# EAGLE design TMdojo-Current-Sensor_v0p2 (EAGLE 7.3.0)
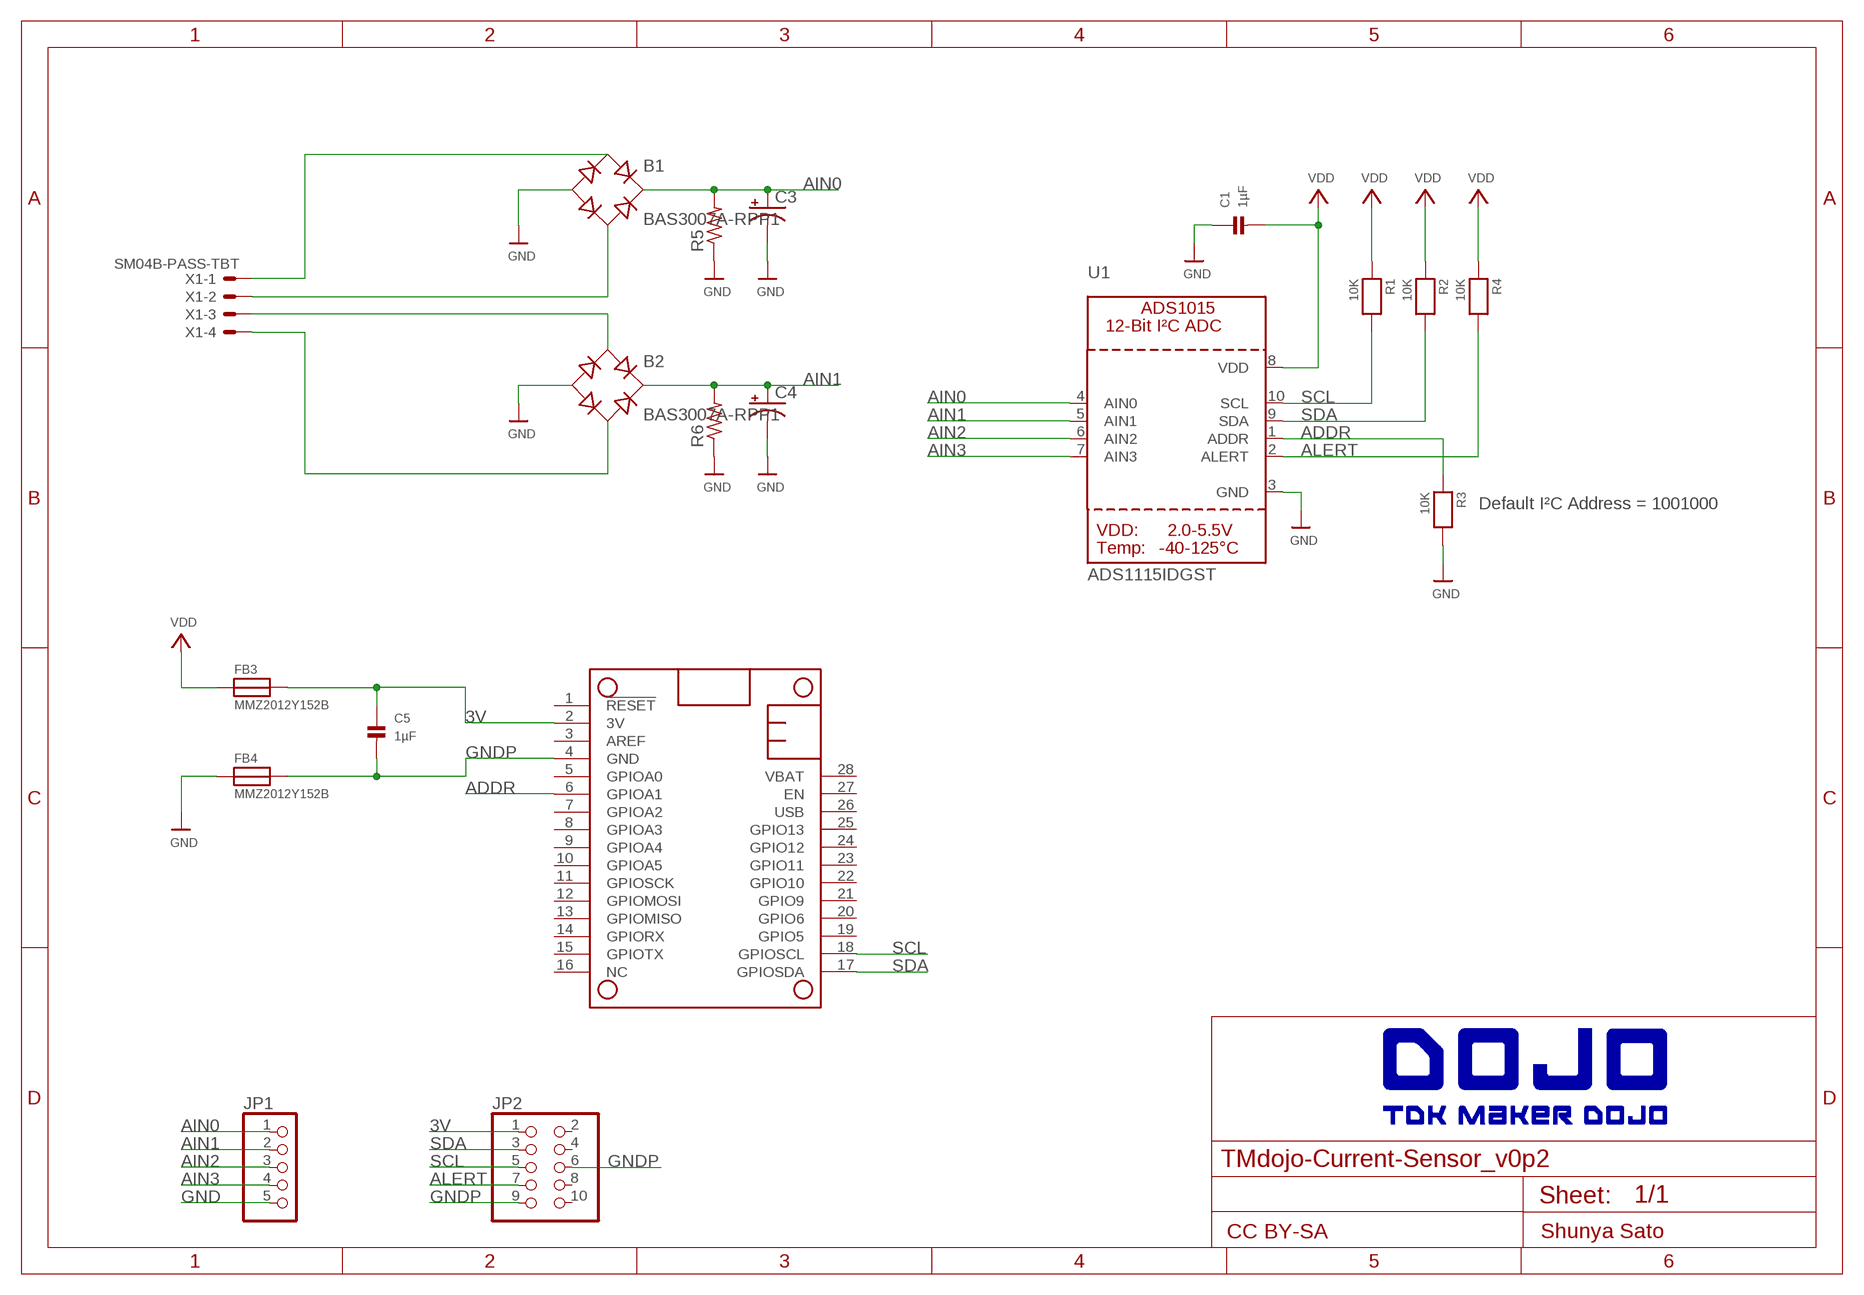
[diagram p0: schematic, sheet 1]

## Parts
B1  BAS3007A-RPP1  [SOT143]
B2  BAS3007A-RPP1  [SOT143]
C1  1µF  CAP_CERAMIC0805  [0805]
C3  CPOL-USTT5D7  [TT5D7]
C4  CPOL-USTT5D7  [TT5D7]
C5  1µF  CAP_CERAMIC0805  [0805]
FB3  MMZ2012Y152B  FERRITE0805  [0805]
FB4  MMZ2012Y152B  FERRITE0805  [0805]
JP1  HEADER-1X5ROUND  [1X05_ROUND]
JP2  HEADER-2X5  [2X05]
MS1  FEATHERWING  [FEATHERWING]
R1  10K  RESISTOR0805  [0805]
R2  10K  RESISTOR0805  [0805]
R3  10K  RESISTOR0805  [0805]
R4  10K  RESISTOR0805  [0805]
R5  R-US_FLIPFLOP  [0805-THM]
R6  R-US_FLIPFLOP  [0805-THM]
U1  ADS1115IDGST  ADC_ADS1015  [MSOP10]
X1  SM04B-PASS-TBT  [SM04B-PASS-TBT]

## Nets
3V: C5.1 FB3.2 JP2.1 MS1.2(3V)
ADDR: MS1.6(GPIOA1) R3.1 U1.1(ADDR)
AIN0: B1.+ C3.+ JP1.1 R5.2 U1.4(AIN0)
AIN1: B2.+ C4.+ JP1.2 R6.2 U1.5(AIN1)
AIN2: JP1.3 U1.6(AIN2)
AIN3: JP1.4 U1.7(AIN3)
ALERT: JP2.7 R4.2 U1.2(ALERT)
GND: B1.- B2.- C1.1 C3.- C4.- FB4.1 JP1.5 R3.2 R5.1 R6.1 U1.3(GND)
GNDP: C5.2 FB4.2 JP2.6 JP2.9 MS1.4(GND)
N$3: B1.~1(AC1) X1.1
N$4: B1.~2(AC2) X1.2
N$5: B2.~1(AC1) X1.3
N$6: B2.~2(AC2) X1.4
SCL: JP2.5 MS1.18(GPIOSCL) R1.2 U1.10(SCL)
SDA: JP2.3 MS1.17(GPIOSDA) R2.2 U1.9(SDA)
VDD: C1.2 FB3.1 R1.1 R2.1 R4.1 U1.8(VDD)
Unconnected: JP2.2 JP2.4 JP2.8 JP2.10 MS1.1(!RESET) MS1.3(AREF) MS1.5(GPIOA0) MS1.7(GPIOA2) MS1.8(GPIOA3) MS1.9(GPIOA4) MS1.10(GPIOA5) MS1.11(GPIOSCK) MS1.12(GPIOMOSI) MS1.13(GPIOMISO) MS1.14(GPIORX) MS1.15(GPIOTX) MS1.16(NC) MS1.19(GPIO5) MS1.20(GPIO6) MS1.21(GPIO9) MS1.22(GPIO10) MS1.23(GPIO11) MS1.24(GPIO12) MS1.25(GPIO13) MS1.26(USB) MS1.27(EN) MS1.28(VBAT)

## Notes on the sheet
- Default I²C Address = 1001000
- /Users/shunya/Documents/FrriteKun/dojo_logo_bw2.bmp
- CC BY-SA | Shunya Sato

## Library data of the parts
B1 B2 = d3makers:BAS3007A-RPP: Bridge Rectifier Infineon Technologies Source: http://www.infineon.com/dgdl/bas3007aseries.pdf?folderId=db3a304313d846880113def5812204a1&fileId=db3a3043156fd5730115a286aa19083b
C1 C5 = microbuilder:CAP_CERAMIC: Ceramic Capacitors 0402 - 0402 Surface Mount Capacitors 16pF 50V 5% [Digikey: 445-4899-2-ND] 18pF 50V 5% [Digikey: 490-1281-2-ND] 22pF 50V 5% [Digikey: 490-1283-2-ND] 68pF 50V 5% [Digikey: 490-1289-2-ND] 0.1uF 10V 10% [Digikey: 490-1318-2-ND] 1.0uF 6.3V 10% [Digikey: 490-1320-2-ND] 0603 - 0603 Surface Mount Capacitors 16 pF 50V 5% [Digikey: 445-5051-2-ND] 22 pF 50V [Digikey: PCC220ACVTR-ND] 33 pF 50V 5% [Digikey: 490-1415-1-ND] 56pF 50V 5% [Digikey: 490-1421-1-ND] 220pF 50V 5% [Digikey: 445-1285-1-ND] 680 pF 50V 2200 pF 50V 5% C0G [Digikey: 445-1297-1-ND] 5600 pF 100V 5% X7R [Digikey: 478-3711-1-ND] 0.1 µF 25V 10% [Digikey: PCC2277TR-ND] 0.22 µF 16V 10% X7R [Digikey: 445-1318-1-ND] 1.0 µF 25V 10% [Digikey: 445-5146-2-ND] 0603 - RF Specific 3pF 250V +/-0.1pF RF [Digikey: 712-1347-1-ND] 18 pF 250V 5% [Digikey: 478-3505-1-ND or 712-1322-1-ND] 56 pF 250V 5% C0G RF [Digikey: 490-4867-1-ND] 68 pF 250V RF [Digikey: 490-4868-1-ND] 0805 - 0805 Surface Mount Capacitors 220 pF 250V 2% RF Ceramic Capacitor [Digikey: 712-1398-1-ND] 1000 pF 50V 2% NP0 Ceramic Capacitor [Digikey: 478-3760-1-ND] 0.1 µF 25V 10% Ceramic Capacitor [Digikey: PCC1828TR-ND] 1.0 µF 16V 10% Ceramic Capacitor[Digikey: 490-1691-2-ND] 10.0 µF 10V 10% Ceramic Capacitor[Digikey: 709-1228-1-ND] 10.0 uF 16V 10% Ceramic Capacitor [Digikey: 478-5165-2-ND] 47 uF 6.3V 20% Ceramic Capacitor [Digikey: 587-1779-1-ND or 399-5506-1-ND] 1206 - 1206 Surface Mount Capacitors 47uF 10V 20% Ceramic Capacitor [Digikey: 490-5528-1-ND or 399-5508-1-ND or 445-6010-1-ND] 100uF 6.3V -20%, +80% Y5V Ceramic Capacitor (Digikey: 490-4512-1-ND, Mouser: 81-GRM31CF50J107ZE1L)
C3 C4 = adafruit:CPOL-US: POLARIZED CAPACITOR, American symbol
FB3 FB4 = microbuilder:FERRITE: Ferrite Bead 0603 MMZ1608B121C - 120 Ohm, 600mA Ferrite Chip - Digikey: 445-2164-1-ND BK1608HW121-T - 120 Ohm, 600mA Ferrite Chip - Digikey: 587-1876-2-ND 0805 HZ0805B272R-10 - 2.7K Ohm @ 100MHz, 200mA 0.8 Ohm DC Resistance - Digikey: 240-2504-1-ND (see also Murata BLM21BD272SN1L)
JP1 = microbuilder:HEADER-1X5: PIN HEADER
JP2 = microbuilder:HEADER-2X5: PIN HEADER
MS1 = adafruit:FEATHERWING
R1-R4 = microbuilder:RESISTOR: Resistors 0402 - 0402 Surface Mount Package 22 Ohm 1% 1/16W [Digikey: 311-22.0LRTR-ND] 33 Ohm 5% 1/16W 1.0K 5% 1/16W 1.5K 5% 1/16W 2.0K 1% 1/16W 10.0K 1% 1/16W [Digikey: 311-10.0KLRTR-ND] 10.0K 5% 1/16W [Digikey: RMCF0402JT10K0TR-ND] 12.1K 1% 1/16W [Digikey: 311-22.0LRTR-ND] 100.0K 5% 1/16W 0603 - 0603 Surface Mount Package 0 Ohm 1/10 Watt 1% Resistor 15 Ohm 1/10 Watt 1% Resistor 33 Ohm 1/10 Watt 1% Resistor 49.9 Ohm 1/10 Watt 1% Resistor 100 Ohm 1/10 Watt 1% Resistor 150 Ohm 1/10 Watt 1% Resistor 240 Ohm 1/10 Watt 1% Resistor 390 Ohm 1/10 Watt 1% Resistor 560 Ohm 1/10 Watt 1% Resistor 680 Ohm 1/10 Watt 1% Resistor 750 Ohm 1/10 Watt 1% Resistor 1.0K Ohm 1/10 Watt 1% Resistor 1.5K Ohm 1/10 Watt 1% Resistor 2.0K Ohm 1/10 Watt 1% Resistor 2.2K Ohm 1/10 Watt 1% Resistor 3.3K Ohm 1/10 Watt 1% Resistor 4.7K Ohm 1/10 Watt 1% Resistor 10.0K Ohm 1/10 Watt 1% Resistor 12.0K Ohm 1/10 Watt 1% Resistor 12.1K Ohm 1/10 Watt 1% Resistor 20.0K Ohm 1/10 Watt 1% Resistor 33.0K Ohm 1/10 Watt 1% Resistor 100.0K Ohm 1/10 Watt 1% Resistor 0805 - 0805 Surface Mount Package 0 Ohm 1/8 Watt 1% Resistor 33 Ohm 1/8 Watt 1% Resistor 100 Ohm 1/8 Watt 1% Resistor 150 Ohm 1/8 Watt 1% Resistor 200 Ohm 1/8 Watt 1% Resistor 240 Ohm 1/8 Watt 1% Resistor 330 Ohm 1/8 Watt 1% Resistor 390 Ohm 1/8 Watt 1% Resistor 470 Ohm 1/8 Watt 1% Resistor 1.0K Ohm 1/8 Watt 1% Resistor 1.5K Ohm 1/8 Watt 1% Resistor 2.0K Ohm 1/8 Watt 1% Resistor 4.7K Ohm 1/8 Watt 1% Resistor 5.1K Ohm 1/8 Watt 1% Resistor 5.6K Ohm 1/8 Watt 1% Resistor 10.0K Ohm 1/8 Watt 1% Resistor 22.0K Ohm 1/8 Watt 1% Resistor 33.0K Ohm 1/8 Watt 1% Resistor 100K Ohm 1/8 Watt 1% Resistor 1206 - 1206 Surface Mount Package 2012 - 2010 Surface Mount Package 0.11 Ohm 1/2 Watt 1% Resistor - Digikey: RHM.11UCT-ND
R5 R6 = adafruit:R-US_: RESISTOR, American symbol
U1 = microbuilder:ADC_ADS1015: ADS1015 - 12-bit 4-Channel I2C ADC with Internal PGA VDD: 2.0-5.5V Sampling Rate: 3.3ksps Gain Settings: 2/3, 1, 2, 4, 8, 16 I2C Address: ADDR low = 1001000x, ADDR high = 1001001x Internal Comparator The ADS1015 includes an internal comparator that can be set to output a high-level on ALERT when the conversion results exceeeds a pre-defined upper level, and will deassert itself when the level falls below a pre-defined lower threshold level. It can also be set to windowed mode where the ALERT pin will be asserted if the data exceeds the upper threshold or falls below the lower threshold.
X1 = d3makers:SM04B-PASS-TBT: Disconnectable Insulation displacement connector, 1.0mm pitch 4 contacts

## Board
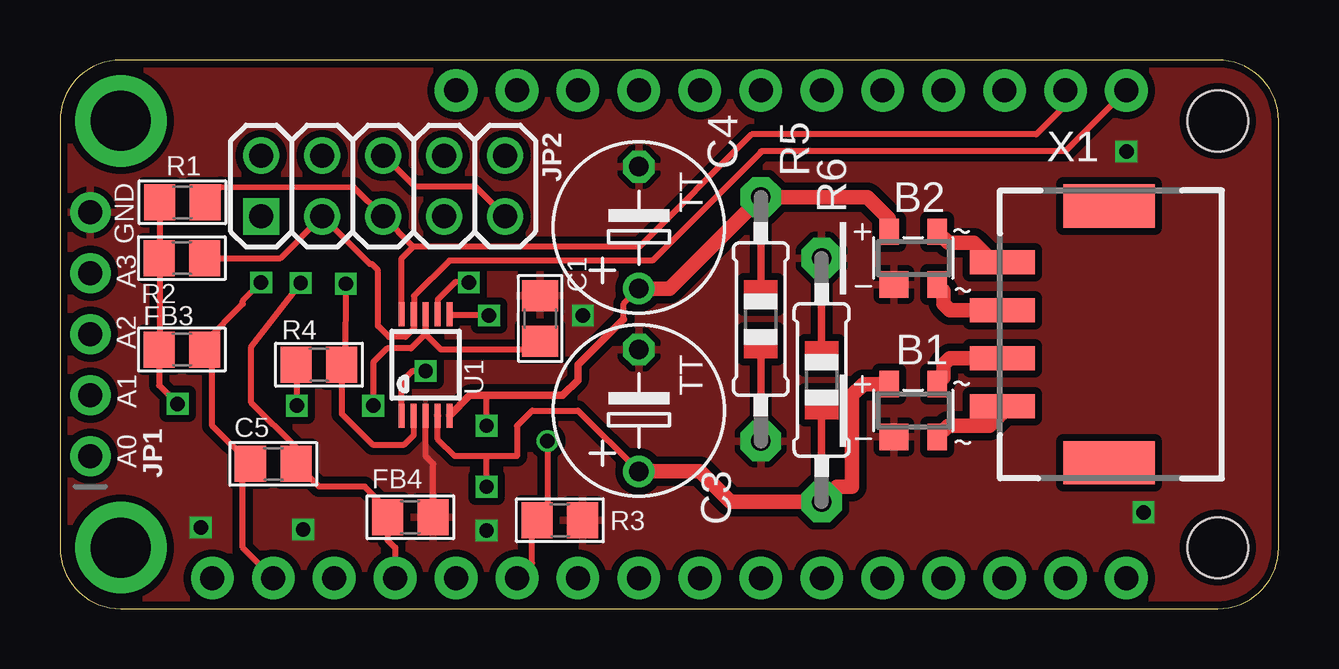
[diagram p1: board, top side]
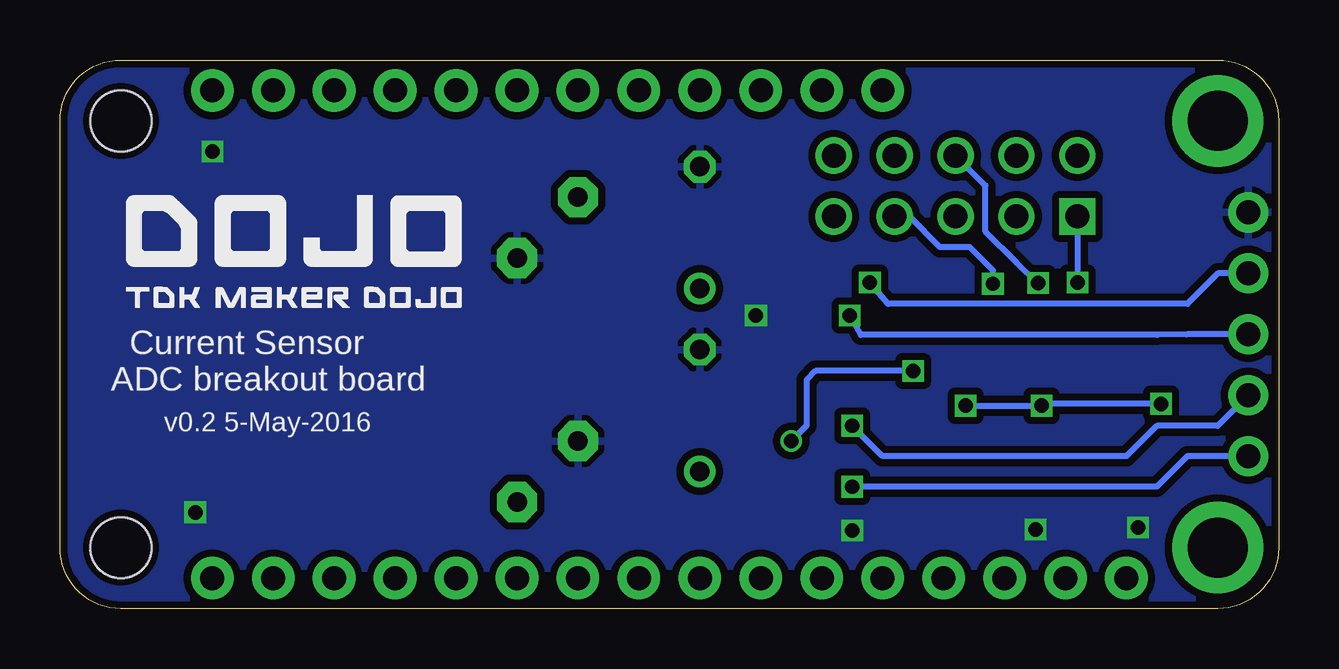
[diagram p2: board, bottom side, seen from below]

Size 50.8 x 22.86 mm. Coordinates in mm from the lower left corner, seen from the top.
Copper layers (1*16): Top 0.035mm / dielectric 1.5mm / Bottom 0.035mm
Design rules "SeeedStudio_2layer_DRU_no_angle_20140221": minimum track width 6mil, minimum drill 12mil, track to track 6mil, track to pad 6mil, pad to pad 6mil, via to via 6mil, smd to smd 0mil, copper to edge 10mil, drill to drill 10mil, minimum pad ring 10mil, minimum via ring 6mil, stop-mask expansion 2mil, vias tented up to drill 100mil, thermal gap 10mil

### Footprints (pad centres in the part's own frame; a part is rotated, then mirrored left to right if it is on the bottom)
SOT143 = smd 0.8 x 1.1: + -1,1.1; ~1 1,-1.1; ~2 1,1.1 | smd 1.2 x 1.1: - -0.8,-1.1
0805 = smd 1.3 x 1.5: 1 -0.95,0; 2 0.95,0
TT5D7 = drill 0.813: + -2.54,0 | drill 0.813 octagon: - 2.54,0
1X05_ROUND = drill 1 pad 1.676: 1 -5.08,0; 2 -2.54,0; 3 0,0; 4 2.54,0; 5 5.08,0
2X05 = drill 1 square: 1 -5.08,-1.27 | drill 1: 2 -5.08,1.27; 3 -2.54,-1.27; 4 -2.54,1.27; 5 0,-1.27; 6 0,1.27; 7 2.54,-1.27; 8 2.54,1.27; 9 5.08,-1.27; 10 5.08,1.27
FEATHERWING = drill 1 pad 1.778: 1 6.35,1.27; 2 8.89,1.27; 3 11.43,1.27; 4 13.97,1.27; 5 16.51,1.27; 6 19.05,1.27; 7 21.59,1.27; 8 24.13,1.27; 9 26.67,1.27; 10 29.21,1.27; 11 31.75,1.27; 12 34.29,1.27; 13 36.83,1.27; 14 39.37,1.27; 15 41.91,1.27; 16 44.45,1.27; 17 44.45,21.59; 18 41.91,21.59; 19 39.37,21.59; 20 36.83,21.59; 21 34.29,21.59; 22 31.75,21.59; 23 29.21,21.59; 24 26.67,21.59; 25 24.13,21.59; 26 21.59,21.59; 27 19.05,21.59; 28 16.51,21.59 | drill 2.5 pad 3.81: P$1 2.54,20.32; P$2 2.54,2.54 | hole 2.54: 48.26,20.32; 48.26,2.54
0805-THM = drill 0.813 pad 1.676 octagon: 1 -5.08,0; 2 5.08,0
MSOP10 = smd 0.25 x 1: 1 -1,-2.113; 2 -0.5,-2.113; 3 0,-2.113; 4 0.5,-2.113; 5 1,-2.113; 6 1,2.113; 7 0.5,2.113; 8 0,2.113; 9 -0.5,2.113; 10 -1,2.113
SM04B-PASS-TBT = smd 1 x 2.7: 1 -3,3.9; 2 -1,3.9; 3 1,3.9; 4 3,3.9 | smd 1.8 x 3.8: FIT@1 -5.35,-0.55; FIT@2 5.35,-0.55

### Placement (x,y rotation side)
B1  35.56,8.26 0 top
B2  35.56,14.61 0 top
C1  20.02,12.09 270 top
C3  24.13,8.26 90 top
C4  24.13,15.88 90 top
C5  8.89,6.03 0 top
FB3  5.08,10.79 0 top
FB4  14.61,3.81 180 top
JP1  1.27,11.43 90 top
JP2  13.47,17.61 0 top
MS1  0,0 0 top
R1  5.11,16.93 0 top
R2  5.08,14.61 0 top
R3  20.84,3.68 0 top
R4  10.79,10.16 0 top
R5  31.75,9.53 270 top
R6  29.21,12.07 90 top
U1  15.24,10.16 0 top
X1  43.18,11.43 90 top

### Tracks (layer width: path | path; a pad name or v marks a point on that pad's centre or on a via)
3V  (via drill 0.6)
  Top 0.254: MS1.2 7.62,2.54 7.62,5.71 C5.1 6.35,7.62 6.35,10.48 FB3.2 6.03,11.11 7.62,12.7 7.62,12.83 v8.38,13.59
  Bottom 0.254: v8.38,13.59 JP2.1
ADDR  (via drill 0.6)
  Top 0.254: U1.1 14.24,9.46 14.27,9.46 14.71,9.91 v15.24,9.91 | v20.32,6.99 20.32,4.11 R3.1 19.68,3.48 19.68,1.91 MS1.6
  Bottom 0.254: v15.24,9.91 19.3,9.91 19.68,9.53 19.68,7.62 v20.32,6.99
AIN0  (via drill 0.6)
  Top 0.254: 17.78,6.35 19.05,6.35 19.05,7.62 19.68,8.26 21.59,8.26 C3.+ | 17.78,6.35 16.46,6.35 15.75,7.06 15.75,8.04 | v17.78,5.08 17.78,6.35
  Top 0.305: 15.75,8.04 U1.4
  Top 0.61: B1.+ 33.48,9.35 33.02,8.89 33.02,5.08 32.38,5.08 R5.2 27.94,4.45 26.67,5.72 C3.+
  Bottom 0.254: JP1.1 3.81,6.35 5.08,5.08 v17.78,5.08
AIN1  (via drill 0.6)
  Top 0.254: v17.78,7.62 17.78,8.89 | 23.5,12.07 23.5,12.7 C4.+
  Top 0.305: 23.5,12.07 21.59,10.16 21.59,9.52 20.95,8.89 17.78,8.89 17.08,8.89 U1.5
  Top 0.61: B2.+ 34.56,16.24 33.65,17.15 R6.2 | R6.2 | C4.+ 25.4,13.34 R6.2
  Bottom 0.254: JP1.2 2.54,7.62 5.08,7.62 6.35,6.35 16.51,6.35 v17.78,7.62
AIN2  (via drill 0.6)
  Top 0.254: v17.88,12.22 16.3,12.22 U1.6
  Bottom 0.254: JP1.3 3.84,11.43 5.08,11.4 17.42,11.4 v17.88,12.22
AIN3  (via drill 0.6)
  Top 0.254: v17.04,13.59 16.48,13.61 15.75,12.88 15.75,12.28 U1.7
  Bottom 0.254: JP1.4 2.54,13.97 3.81,12.7 16.28,12.7 v17.04,13.59
ALERT  (via drill 0.6)
  Top 0.254: U1.2 14.76,8.03 14.76,7.24 14.35,6.83 13.03,6.83 11.74,8.12 R4.2 11.89,10.35 v11.91,13.54
  Bottom 0.254: JP2.7 15.4,16.34 14.12,15.06 12.88,15.06 11.91,14.1 v11.91,13.54
GND  (via drill 0.6)
  Top 0.254: FB4.1 15.55,6.04 15.24,6.35 U1.3
  other vias: 5.87,3.38 10.13,3.3 17.78,3.25 44.45,19.05 45.16,4.01 21.79,12.22
  pour Bottom (isolate 0.305): 0,0 0,22.86 50.8,22.81 50.8,-0.05
  pour Top (isolate 0.305): 0,0 0,22.86 50.8,22.95 50.8,0.09
GNDP  (via drill 0.6)
  Top 0.254: JP2.6 13.51,18.88 14.78,17.6 17.27,17.6 17.3,17.58 17.31,17.58 JP2.9 | MS1.4 13.97,2.54 13.65,2.85 FB4.2 13.65,4.13 12.7,5.08 10.79,5.08 C5.2 9.84,6.72 7.98,8.59 7.98,10.92 v10.03,13.56
  Bottom 0.254: v10.03,13.56 10.92,14.4 12.22,15.7 12.22,17.63 JP2.6
N$3
  Top 0.61: X1.1 39.28,8.17 38.73,7.62 37.03,7.62 B1.~1
N$4
  Top 0.61: X1.2 37.1,10.43 36.83,10.16 36.83,9.62 B1.~2
N$5
  Top 0.61: X1.3 37.1,12.43 36.83,12.7 36.83,13.24 B2.~1
N$6
  Top 0.61: X1.4 38.91,14.43 38.1,15.24 37.02,15.24 B2.~2
SCL
  Top 0.254: MS1.18 41.91,20.98 40.69,19.76 28.83,19.76 24.16,15.09 14.72,15.09 | R1.2 6.71,17.58 12.25,17.56 JP2.5 14.72,15.09 | U1.10 14.24,14.61 14.72,15.09
SDA
  Top 0.254: MS1.17 41.91,19.05 29.21,19.05 29.21,19.02 24.69,14.5 16.23,14.5 14.76,13.03 14.76,12.29 | R2.2 9.2,14.6 JP2.3 | JP2.3 10.99,16.34 | 14.76,12.29 U1.9 | 14.76,12.29 14.76,11.68 14.4,11.33 13.72,11.33 13.26,11.79 13.26,14.1 13,14.35 12.92,14.35 JP2.3
VDD  (via drill 0.6)
  Top 0.254: R1.1 4.16,14.63 | 4.16,14.63 R2.1 | 4.16,14.63 4.16,10.82 FB3.1 4.13,9.31 v4.9,8.53 | v9.88,8.46 9.88,10.12 R4.1 | v13.06,8.46 13.06,10.26 13.64,10.85 14.63,10.85 15.24,11.46 U1.8 15.24,11.43 15.88,10.79 19.67,10.79 C1.2
  Bottom 0.254: v4.9,8.53 9.8,8.53 v9.88,8.46 v13.06,8.46

### Text on the board
tPlace: GND | A3 | A2 | A1 | A0
bNames: Current Sensor / ADC breakout board | v0.2 5-May-2016